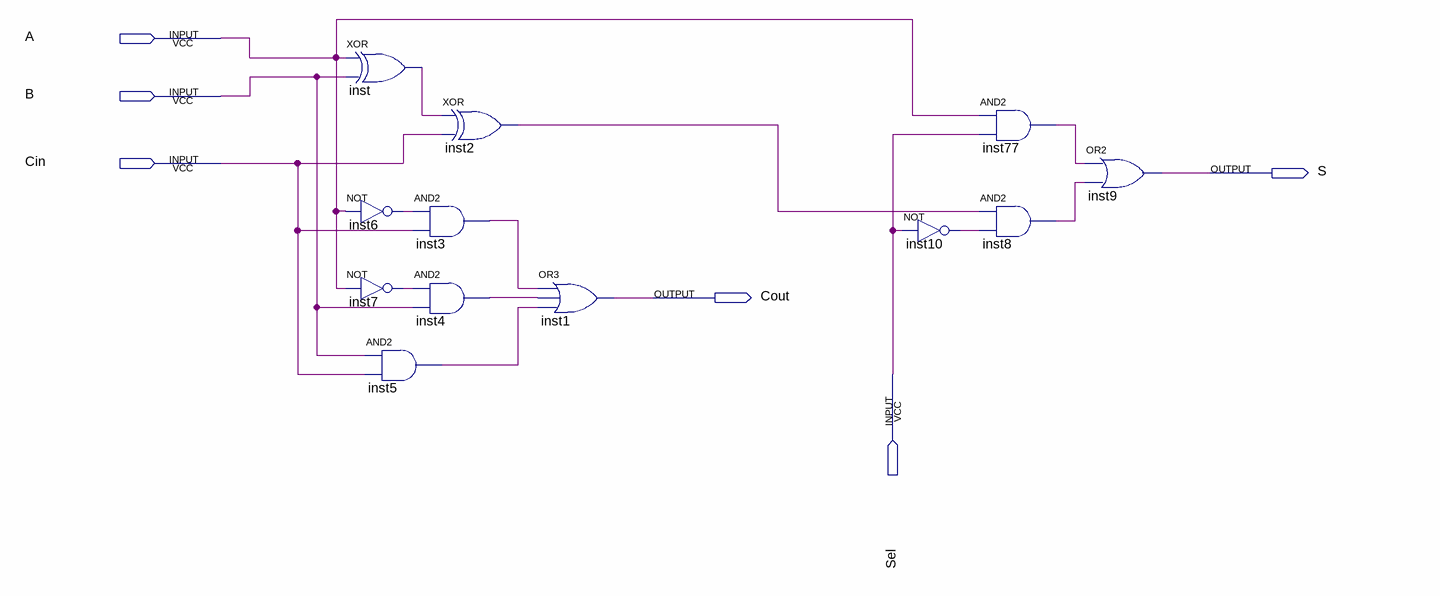
[diagram p0: schematic sheet]
// Quartus schematic divisor.bdf as structural Verilog: 12 symbols, 6 pins
module divisor (
  input  A,
  input  B,
  input  Cin,
  input  Sel,
  output S,
  output Cout
);

  wire inst2_out, inst3_out, inst4_out, inst5_out, inst6_out, inst7_out, inst8_out, inst10_out, inst77_out,
       inst_out;

  xor inst (inst_out, A, B);
  not inst6 (inst6_out, A);
  not inst7 (inst7_out, A);
  and inst5 (inst5_out, B, Cin);
  xor inst2 (inst2_out, inst_out, Cin);
  and inst3 (inst3_out, inst6_out, Cin);
  and inst4 (inst4_out, inst7_out, B);
  or inst1 (Cout, inst3_out, inst4_out, inst5_out);
  not inst10 (inst10_out, Sel);
  and inst77 (inst77_out, A, Sel);
  and inst8 (inst8_out, inst2_out, inst10_out);
  or inst9 (S, inst77_out, inst8_out);
endmodule
